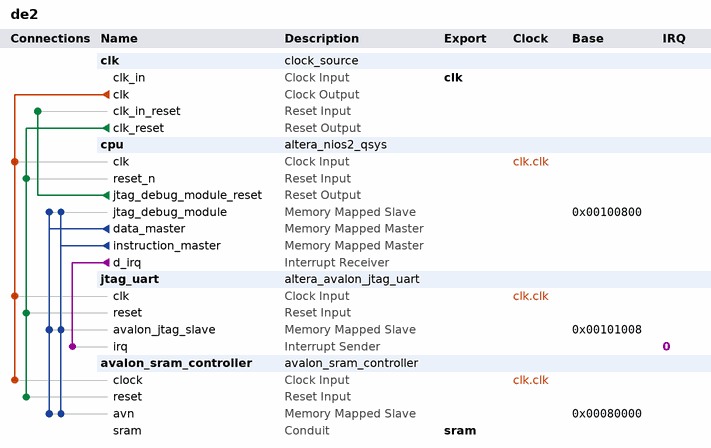
[diagram p0: system contents]
# Platform Designer (Qsys) system de2, Cyclone IV GX Unknown
# Parameters at their usual value, and those the tool derives, are not listed.
package require -exact qsys 13.0
create_system de2
set_project_property DEVICE_FAMILY {Cyclone IV GX}
set_project_property DEVICE Unknown

add_instance clk clock_source 13.0
set_instance_parameter_value clk clockFrequency 50000000

add_instance cpu altera_nios2_qsys 13.0
set_instance_parameter_value cpu resetSlave avalon_sram_controller.avn
set_instance_parameter_value cpu mmu_TLBMissExcSlave None
set_instance_parameter_value cpu exceptionSlave avalon_sram_controller.avn
set_instance_parameter_value cpu breakSlave cpu.jtag_debug_module
set_instance_parameter_value cpu impl Tiny
set_instance_parameter_value cpu icache_size 4096

add_instance jtag_uart altera_avalon_jtag_uart 13.0.1.99.2
set_instance_parameter_value jtag_uart simInteractiveOptions NO_INTERACTIVE_WINDOWS

add_instance avalon_sram_controller avalon_sram_controller 1.0
set_instance_parameter_value avalon_sram_controller AVN_AW 18
set_instance_parameter_value avalon_sram_controller AVN_DW 16

# connections
add_connection clk.clk avalon_sram_controller.clock clock
add_connection clk.clk cpu.clk clock
add_connection clk.clk jtag_uart.clk clock
add_connection clk.clk_reset avalon_sram_controller.reset reset
add_connection clk.clk_reset cpu.reset_n reset
add_connection clk.clk_reset jtag_uart.reset reset
add_connection cpu.jtag_debug_module_reset clk.clk_in_reset reset
add_connection cpu.data_master avalon_sram_controller.avn avalon
set_connection_parameter_value cpu.data_master/avalon_sram_controller.avn baseAddress 0x00080000
add_connection cpu.data_master cpu.jtag_debug_module avalon
set_connection_parameter_value cpu.data_master/cpu.jtag_debug_module baseAddress 0x00100800
add_connection cpu.data_master jtag_uart.avalon_jtag_slave avalon
set_connection_parameter_value cpu.data_master/jtag_uart.avalon_jtag_slave baseAddress 0x00101008
add_connection cpu.instruction_master avalon_sram_controller.avn avalon
set_connection_parameter_value cpu.instruction_master/avalon_sram_controller.avn baseAddress 0x00080000
add_connection cpu.instruction_master cpu.jtag_debug_module avalon
set_connection_parameter_value cpu.instruction_master/cpu.jtag_debug_module baseAddress 0x00100800
add_connection cpu.instruction_master jtag_uart.avalon_jtag_slave avalon
set_connection_parameter_value cpu.instruction_master/jtag_uart.avalon_jtag_slave baseAddress 0x00101008
add_connection cpu.d_irq jtag_uart.irq interrupt
set_connection_parameter_value cpu.d_irq/jtag_uart.irq irqNumber 0

# exported interfaces
add_interface clk clock sink
set_interface_property clk EXPORT_OF clk.clk_in
add_interface sram conduit end
set_interface_property sram EXPORT_OF avalon_sram_controller.sram

set_interconnect_requirement {$system} qsys_mm.clockCrossingAdapter HANDSHAKE
set_interconnect_requirement {$system} qsys_mm.maxAdditionalLatency 1

save_system de2.qsys
